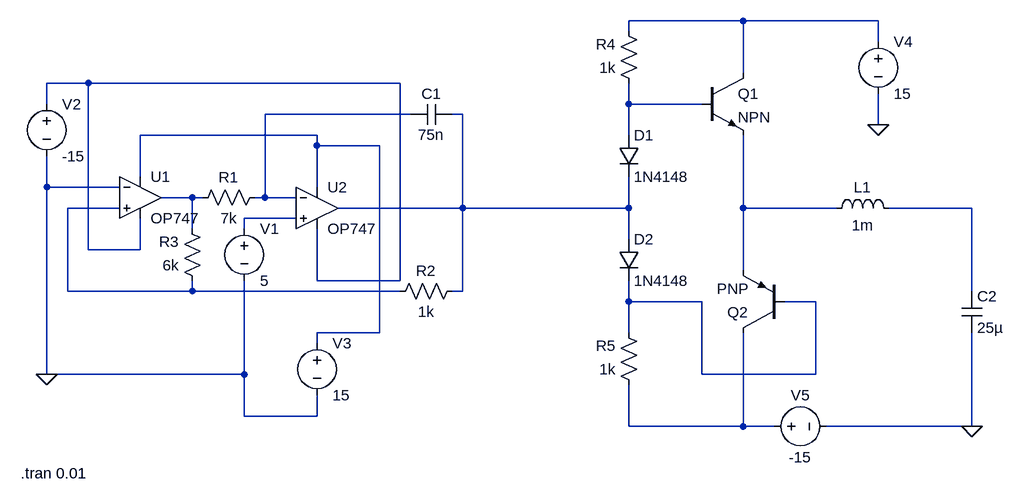
[diagram p0: schematic Sinusoid_generator.asc]
Sinusoid_generator.asc, the LTspice schematic file:
Version 4
SHEET 1 1684 680
WIRE 1120 -112 944 -112
WIRE 1328 -112 1120 -112
WIRE 944 -96 944 -112
WIRE 1328 -80 1328 -112
WIRE 1120 -32 1120 -112
WIRE 112 -16 48 -16
WIRE 592 -16 112 -16
WIRE 48 16 48 -16
WIRE 944 16 944 -16
WIRE 1056 16 944 16
WIRE 608 32 384 32
WIRE 688 32 672 32
WIRE 1328 48 1328 0
WIRE 464 64 192 64
WIRE 944 64 944 16
WIRE 464 80 464 64
WIRE 560 80 464 80
WIRE 192 128 192 64
WIRE 48 144 48 96
WIRE 160 144 48 144
WIRE 464 144 464 80
WIRE 272 160 224 160
WIRE 288 160 272 160
WIRE 384 160 384 32
WIRE 384 160 368 160
WIRE 432 160 384 160
WIRE 160 176 80 176
WIRE 688 176 688 32
WIRE 688 176 496 176
WIRE 944 176 944 128
WIRE 944 176 688 176
WIRE 1120 176 1120 64
WIRE 1264 176 1120 176
WIRE 1472 176 1344 176
WIRE 432 192 352 192
WIRE 272 208 272 160
WIRE 352 208 352 192
WIRE 944 224 944 176
WIRE 112 240 112 -16
WIRE 192 240 192 192
WIRE 192 240 112 240
WIRE 1120 272 1120 176
WIRE 464 288 464 208
WIRE 592 288 592 -16
WIRE 592 288 464 288
WIRE 80 304 80 176
WIRE 272 304 272 288
WIRE 272 304 80 304
WIRE 592 304 272 304
WIRE 688 304 688 176
WIRE 688 304 672 304
WIRE 1472 304 1472 176
WIRE 944 320 944 288
WIRE 1056 320 944 320
WIRE 1232 320 1184 320
WIRE 560 368 560 80
WIRE 560 368 464 368
WIRE 944 368 944 320
WIRE 464 384 464 368
WIRE 48 432 48 144
WIRE 352 432 352 288
WIRE 352 432 48 432
WIRE 1056 432 1056 320
WIRE 1232 432 1232 320
WIRE 1232 432 1056 432
WIRE 352 496 352 432
WIRE 464 496 464 464
WIRE 464 496 352 496
WIRE 944 512 944 448
WIRE 1120 512 1120 368
WIRE 1120 512 944 512
WIRE 1168 512 1120 512
WIRE 1472 512 1472 368
WIRE 1472 512 1248 512
FLAG 1472 512 0
FLAG 1328 48 0
FLAG 48 432 0
SYMBOL OpAmps\\OP747 192 96 R0
SYMATTR InstName U1
SYMBOL OpAmps\\OP747 464 112 R0
SYMATTR InstName U2
SYMBOL res 384 144 R90
WINDOW 0 0 56 VBottom 2
WINDOW 3 32 56 VTop 2
SYMATTR InstName R1
SYMATTR Value 7k
SYMBOL res 688 288 R90
WINDOW 0 0 56 VBottom 2
WINDOW 3 32 56 VTop 2
SYMATTR InstName R2
SYMATTR Value 1k
SYMBOL res 288 304 R180
WINDOW 0 36 76 Left 2
WINDOW 3 36 40 Left 2
SYMATTR InstName R3
SYMATTR Value 6k
SYMBOL res 960 0 R180
WINDOW 0 36 76 Left 2
WINDOW 3 36 40 Left 2
SYMATTR InstName R4
SYMATTR Value 1k
SYMBOL res 960 464 R180
WINDOW 0 36 76 Left 2
WINDOW 3 36 40 Left 2
SYMATTR InstName R5
SYMATTR Value 1k
SYMBOL cap 672 16 R90
WINDOW 0 0 32 VBottom 2
WINDOW 3 32 32 VTop 2
SYMATTR InstName C1
SYMATTR Value 75n
SYMBOL voltage 352 192 R0
WINDOW 123 0 0 Left 0
WINDOW 39 0 0 Left 0
SYMATTR InstName V1
SYMATTR Value 5
SYMBOL voltage 48 0 R0
WINDOW 123 0 0 Left 0
WINDOW 39 0 0 Left 0
SYMATTR InstName V2
SYMATTR Value -15
SYMBOL voltage 464 368 R0
WINDOW 123 0 0 Left 0
WINDOW 39 0 0 Left 0
SYMATTR InstName V3
SYMATTR Value 15
SYMBOL voltage 1328 -96 R0
WINDOW 123 0 0 Left 0
WINDOW 39 0 0 Left 0
SYMATTR InstName V4
SYMATTR Value 15
SYMBOL voltage 1152 512 R270
WINDOW 0 32 56 VTop 2
WINDOW 3 -32 56 VBottom 2
WINDOW 123 0 0 Left 0
WINDOW 39 0 0 Left 0
SYMATTR InstName V5
SYMATTR Value -15
SYMBOL cap 1456 304 R0
SYMATTR InstName C2
SYMATTR Value 25µ
SYMBOL diode 928 64 R0
SYMATTR InstName D1
SYMATTR Value 1N4148
SYMBOL diode 928 224 R0
SYMATTR InstName D2
SYMATTR Value 1N4148
SYMBOL ind 1248 192 R270
WINDOW 0 32 56 VTop 2
WINDOW 3 5 56 VBottom 2
SYMATTR InstName L1
SYMATTR Value 1m
SYMBOL npn 1056 -32 R0
SYMATTR InstName Q1
SYMBOL pnp 1184 368 R180
SYMATTR InstName Q2
TEXT 8 584 Left 2 !.tran 0.01

The netlist it stands for:
* Sinusoid_generator.asc
XU1 N008 0 N006 N002 N007 OP747  ; pins In+ In- V+ V- OUT
XU2 N011 N004 N006 N002 N005 OP747  ; pins In+ In- V+ V- OUT
R1 N004 N007 7k
R2 N005 N008 1k
R3 N008 N007 6k
R4 N003 N001 1k
R5 N013 N012 1k
C1 N005 N004 75n
V1 N011 0 5
V2 N002 0 -15
V3 N006 0 15
V4 N001 0 15
V5 N013 0 -15
C2 N010 0 25µ
D1 N003 N005 1N4148
D2 N005 N012 1N4148
L1 N009 N010 1m
Q1 N001 N003 N009 0 NPN
Q2 N013 N012 N009 0 PNP
.model D D
.lib standard.dio
.model NPN NPN
.model PNP PNP
.lib standard.bjt
.tran 0.01
.backanno
.end